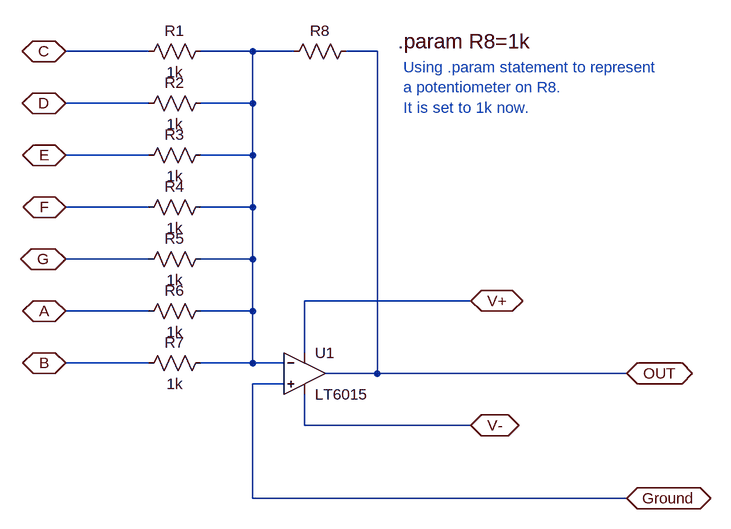
[diagram p0: schematic Mixer_Square.asc]
Mixer_Square.asc, the LTspice schematic file:
Version 4
SHEET 1 1716 680
WIRE -32 -608 -160 -608
WIRE 128 -608 48 -608
WIRE 192 -608 128 -608
WIRE 320 -608 272 -608
WIRE -32 -528 -160 -528
WIRE 128 -528 128 -608
WIRE 128 -528 48 -528
WIRE -32 -448 -160 -448
WIRE 128 -448 128 -528
WIRE 128 -448 48 -448
WIRE -32 -368 -160 -368
WIRE 128 -368 128 -448
WIRE 128 -368 48 -368
WIRE -32 -288 -160 -288
WIRE 128 -288 128 -368
WIRE 128 -288 48 -288
WIRE 464 -224 208 -224
WIRE -32 -208 -160 -208
WIRE 128 -208 128 -288
WIRE 128 -208 48 -208
WIRE 208 -144 208 -224
WIRE -32 -128 -160 -128
WIRE 128 -128 128 -208
WIRE 128 -128 48 -128
WIRE 176 -128 128 -128
WIRE 320 -112 320 -608
WIRE 320 -112 240 -112
WIRE 704 -112 320 -112
WIRE 176 -96 128 -96
WIRE 208 -32 208 -80
WIRE 464 -32 208 -32
WIRE 128 80 128 -96
WIRE 704 80 128 80
FLAG -160 -608 C
IOPIN -160 -608 BiDir
FLAG -160 -528 D
IOPIN -160 -528 BiDir
FLAG -160 -448 E
IOPIN -160 -448 BiDir
FLAG -160 -368 F
IOPIN -160 -368 BiDir
FLAG -160 -288 G
IOPIN -160 -288 BiDir
FLAG -160 -208 A
IOPIN -160 -208 BiDir
FLAG -160 -128 B
IOPIN -160 -128 BiDir
FLAG 464 -224 V+
IOPIN 464 -224 BiDir
FLAG 704 -112 OUT
IOPIN 704 -112 BiDir
FLAG 464 -32 V-
IOPIN 464 -32 BiDir
FLAG 704 80 Ground
IOPIN 704 80 BiDir
SYMBOL Opamps\\LT6015 208 -112 R0
SYMATTR InstName U1
SYMBOL res 64 -624 R90
WINDOW 0 0 56 VBottom 2
WINDOW 3 32 56 VTop 2
SYMATTR InstName R1
SYMATTR Value 1k
SYMBOL res 64 -544 R90
WINDOW 0 0 56 VBottom 2
WINDOW 3 32 56 VTop 2
SYMATTR InstName R2
SYMATTR Value 1k
SYMBOL res 64 -464 R90
WINDOW 0 0 56 VBottom 2
WINDOW 3 32 56 VTop 2
SYMATTR InstName R3
SYMATTR Value 1k
SYMBOL res 64 -384 R90
WINDOW 0 0 56 VBottom 2
WINDOW 3 32 56 VTop 2
SYMATTR InstName R4
SYMATTR Value 1k
SYMBOL res 64 -304 R90
WINDOW 0 0 56 VBottom 2
WINDOW 3 32 56 VTop 2
SYMATTR InstName R5
SYMATTR Value 1k
SYMBOL res 64 -224 R90
WINDOW 0 0 56 VBottom 2
WINDOW 3 32 56 VTop 2
SYMATTR InstName R6
SYMATTR Value 1k
SYMBOL res 64 -144 R90
WINDOW 0 0 56 VBottom 2
WINDOW 3 32 56 VTop 2
SYMATTR InstName R7
SYMATTR Value 1k
SYMBOL res 288 -624 R90
WINDOW 0 0 56 VBottom 2
WINDOW 3 32 56 VTop 2
SYMATTR InstName R8
SYMATTR Value ""
TEXT 352 -624 Left 3 !.param R8=1k
TEXT 360 -584 Left 2 ;Using .param statement to represent \na potentiometer on R8.\nIt is set to 1k now.

The netlist it stands for:
* Mixer_Square.asc
XU1 Ground N001 V+ V- OUT LT6016  ; LT6015, pins In+ In- V+ V- OUT
R1 N001 C 1k
R2 N001 D 1k
R3 N001 E 1k
R4 N001 F 1k
R5 N001 G 1k
R6 N001 A 1k
R7 N001 B 1k
R8 OUT N001
.param R8=1k
* Using .param statement to represent
* a potentiometer on R8.
* It is set to 1k now.
.lib LTC2.lib
.backanno
.end